# EasyEDA schematic SCH_botao-bt-V0.1_2026-07-03.json
TITLE: Sheet_1; REV: 1.0; Date: 2021-08-03; Sheet: 1/1; Drawn By: hpflatorre; Company: Your Company
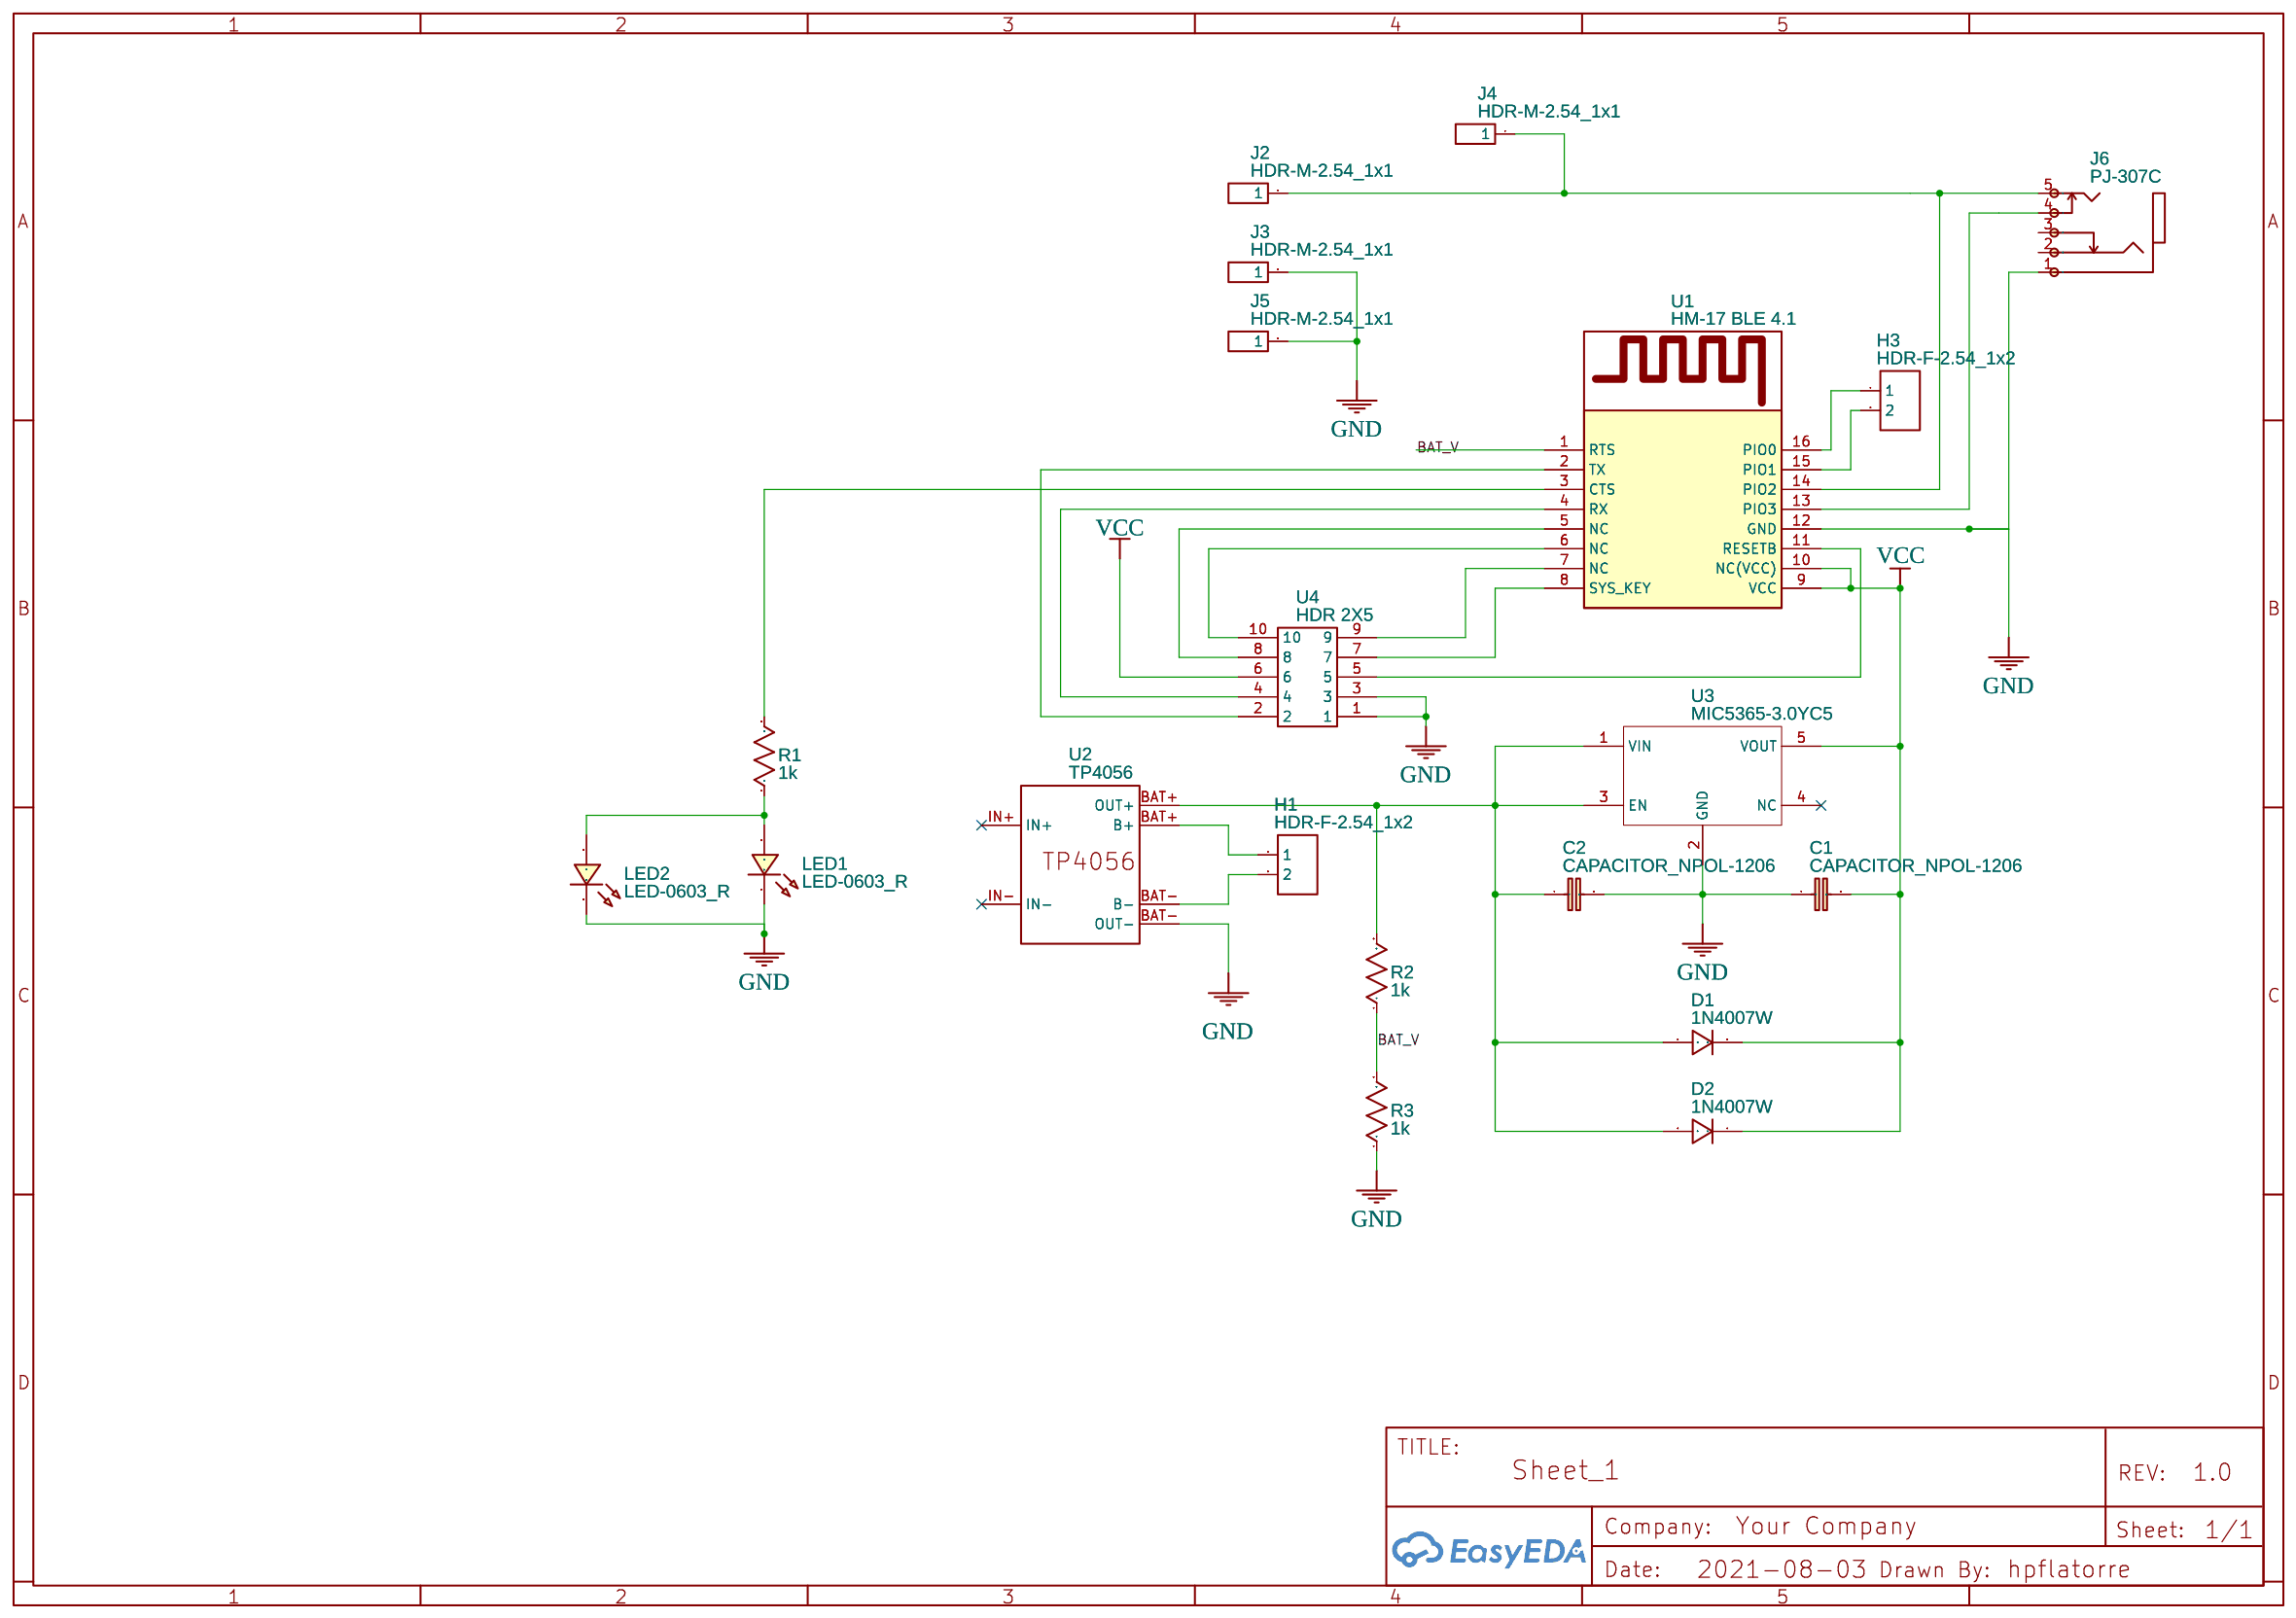
[diagram p0: schematic sheet]

## Parts
C1  CAPACITOR_NPOL-1206  [C1206]
C2  CAPACITOR_NPOL-1206  [C1206]
D1  1N4007W  [SOD-123_L2.8-W1.8-LS3.7-RD]
D2  1N4007W  [DIODE]
H1  HDR-F-2.54_1x2  [HDR-F-2.54_1X2]
H3  HDR-F-2.54_1x2  [HDR-F-2.54_1X2]
J2  HDR-M-2.54_1x1  [HDR-M-2.54_1X1]
J3  HDR-M-2.54_1x1  [HDR-M-2.54_1X1]
J4  HDR-M-2.54_1x1  [HDR-M-2.54_1X1]
J5  HDR-M-2.54_1x1  [HDR-M-2.54_1X1]
J6  PJ-307C  [AUDIO-TH_PJ307C]
LED1  LED-0603_R  [LED0603_RED]
LED2  LED-0603_R  [LED 5MM]
R1  1k  [R0603]
R2  1k  [R0603]
R3  1k  [R0603]
U1  HM-17 BLE 4.1  [HM-11]
U2  TP4056  [TP4056]
U3  MIC5365-3.0YC5  [MIC5365-3.3YC5-TR 3.3V REGULATOR]
U4  HDR 2X5  [CONN-TH_10P-P2.00_PHD2.0MM-2X5]

## Library data of the parts
C1 C2 = CAPACITOR_NPOL-1206: Non-Polarized capacitor in various packages; Contributor: DangerousPrototype
D1 D2 = 1N4007W: Supplier: LCSC; Supplier Part: C328592; Manufacturer: BLUE ROCKET; Contributor: LCEDA_Lib
H1 H3 = HDR-F-2.54_1x2: Supplier Part: C49661; Supplier: LCSC; Contributor: LCEDA_Lib
J2-J5 = HDR-M-2.54_1x1: Supplier Part: C81276; Supplier: LCSC; Contributor: LCEDA_Lib
J6 = PJ-307C: Supplier: LCSC; Manufacturer: BOOMELE; Supplier Part: C16684; JLCPCB Part Class: Extended Part
LED1 LED2 = LED-0603_R: Manufacturer: EVERLIGHT(台湾亿光); Manufacturer Part: 19-217/R6C-AL1M2VY/3T; Supplier Part: C72044; Supplier: LCSC; Contributor: LCEDA_01
R1-R3 = R_0603_US: Contributor: LCEDA_Lib
U1 = HM-17 BLE 4.1: Manufacturer: JNHuamao Technology Company; Supplier Part: HM-17; link: https://www.herman-shop.com/PDF/bluetooth%20hm16%20hm17.pdf; Contributor: sozturk
U2 = TP4056: Manufacturer Part: TP4056-protect; link: https://dlnmh9ip6v2uc.cloudfront.net/datasheets/Prototyping/TP4056.pdf; Contributor: Артем Куницын
U3 = MIC5365-3.0YC5: Availability: Unavailable; Package: SC-70-5; SnapEDA_Link: https://www.snapeda.com/parts/TPS71433DRVR/Texas%20Instruments/view-part/?ref=snap; MF: Micrel/Microchip; Price: None; Contributor: TiX
U4 = HDR 2X5: Supplier: EasyEDA; Contributor: gmcallis

## Nets
GND: C1.1 C2.2 H1.2 J3.1 J5.1 J6.1 LED1.2 LED2.2 R3.1 U1.12(GND) U2.BAT-(OUT-) U3.2(GND) U4.1 U4.3
VCC: C1.2 D1.1 D2.1 U1.9(VCC) U1.10(NC(VCC)) U3.5(VOUT) U4.6
BAT_V: R2.1 R3.2 U1.1(RTS)
Net-(C2-1): C2.1 D1.2 D2.2 H1.1 R2.2 U2.BAT+(OUT+) U3.1(VIN) U3.3(EN)
Net-(H3-1): H3.1 U1.16(PIO0)
Net-(H3-2): H3.2 U1.15(PIO1)
Net-(J2-1): J2.1 J4.1 J6.5 U1.14(PIO2)
Net-(J6-4): J6.4 U1.13(PIO3)
Net-(LED1-1): LED1.1 LED2.1 R1.1
Net-(R1-2): R1.2 U1.3(CTS)
Net-(U1-2): U1.2(TX) U4.2
Net-(U1-4): U1.4(RX) U4.4
Net-(U1-5): U1.5(NC) U4.8
Net-(U1-6): U1.6(NC) U4.10
Net-(U1-7): U1.7(NC) U4.9
Net-(U1-8): U1.8(SYS_KEY) U4.7
Net-(U1-11): U1.11(RESETB) U4.5

Not connected (* = marked no-connect by the designer): J6 2 3; U2 IN+* IN-*; U3 4(NC)*
